# EAGLE design Power Cockpit (EAGLE 5.10)
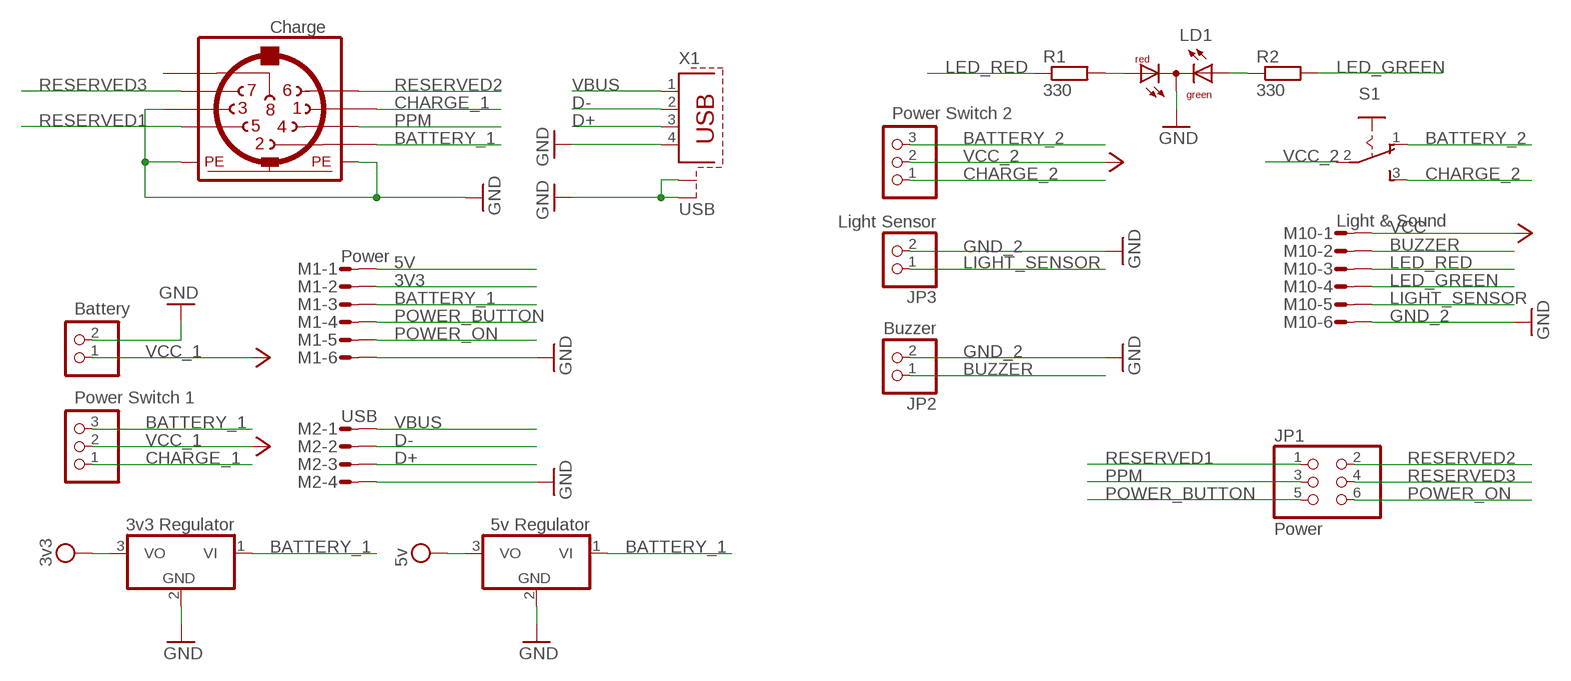
[diagram p0: schematic, sheet 1]

## Parts
BATTERY  Battery  PINHD-1X2  [1X02]
CHARGE  Charge  MAB8SH  [MAB8SH]
IC1  5v Regulator  7805T  [TO220H]
IC3  3v3 Regulator  7805T  [TO220H]
JP1  Power  PINHD-2X3  [2X03]
JP2  Buzzer  PINHD-2X1  [2X01]
JP3  Light Sensor  PINHD-2X1  [2X01]
LD1  DUOLED-RG-C  [DUOLED-C-5MM]
M1  Power  MICROMATCH-6  [MICROMATCH-6]
M2  USB  MICROMATCH-4  [MICROMATCH-4]
M10  Light & Sound  MICROMATCH-6  [MICROMATCH-6]
POWER_SWITCH_1  Power Switch 1  PINHD-1X3  [1X03]
POWER_SWITCH_2  Power Switch 2  PINHD-1X3  [1X03]
R1  330  R-EU_R0603  [R0603]
R2  330  R-EU_R0603  [R0603]
S1  255SB  [255SB]
X1  USB  PN61729-S  [PN61729-S]

## Nets
3V3: IC3.3(VO) M1.2 ; supply symbol labelled 3v3
5V: IC1.3(VO) M1.1 ; supply symbol labelled 5v
BATTERY_1: CHARGE.2 IC1.1(VI) IC3.1(VI) M1.3 POWER_SWITCH_1.3
BATTERY_2: POWER_SWITCH_2.3 S1.1(O)
BUZZER: JP2.1 M10.2
CHARGE_1: CHARGE.1 POWER_SWITCH_1.1
CHARGE_2: POWER_SWITCH_2.1 S1.3(S)
D+: M2.3 X1.3
D-: M2.2 X1.2
GND_1: BATTERY.2 CHARGE.3 CHARGE.PE CHARGE.PE@(PE) IC1.2(GND) IC3.2(GND) M1.6 M2.4 X1.4 X1.S1 X1.S2 ; supply symbol labelled GND
GND_2: JP2.2 JP3.2 LD1.C M10.6 ; supply symbol labelled GND
LED_GREEN: M10.4 R2.2
LED_RED: M10.3 R1.1
LIGHT_SENSOR: JP3.1 M10.5
N$1: LD1.AR R1.2
N$2: LD1.AX(AG) R2.1
POWER_BUTTON: JP1.5 M1.4
POWER_ON: JP1.6 M1.5
PPM: CHARGE.4 JP1.3
RESERVED1: CHARGE.5 JP1.1
RESERVED2: CHARGE.6 JP1.2
RESERVED3: CHARGE.7 JP1.4
VBUS: M2.1 X1.1
VCC: M10.1
VCC_1: BATTERY.1 POWER_SWITCH_1.2 ; supply symbol labelled VCC
VCC_2: POWER_SWITCH_2.2 S1.2(P) ; supply symbol labelled VCC
Unconnected: CHARGE.8

## Library data of the parts
BATTERY = pinhead:PINHD-1X2: PIN HEADER
CHARGE = pst-con-hirschmann:MAB8SH: Female CONNECTOR 8 pins with shield, horizontal (DIN 41524)
IC1 IC3 = pst-dimension-engineering:78*: Positive VOLTAGE REGULATOR Source: http://cache.national.com/ds/LM/LM78L05.pdf http://www.fairchildsemi.com/ds/LM/LM7805.pdf
JP1 = pinhead:PINHD-2X3: PIN HEADER
JP2 JP3 = pst-pinhead:PINHD-2X1
LD1 = led:DUOLED-RG-C: DUO LED 2 colors (red/green), 5 mm, round, common Cathode www.ligitek.com or other producers.
M1 M10 = con-amp-micromatch:MICROMATCH-6: MicroMaTch 6 7-215464-6 / 0-215464-6 Drawing Number C-215464 DDEController.pdf
M2 = con-amp-micromatch:MICROMATCH-4: MicroMaTch 4 7-215464-4 / 0-215464-4 Drawing Number C-215464 DDEController.pdf
POWER_SWITCH_1 POWER_SWITCH_2 = pinhead:PINHD-1X3: PIN HEADER
R1 R2 = resistor:R-EU_: RESISTOR, European symbol
S1 = switch:255SB: SLIDING SWITCH Distributor Buerklin, 11G810
X1 = con-berg:PN61729-S: BERG USB connector

## Board
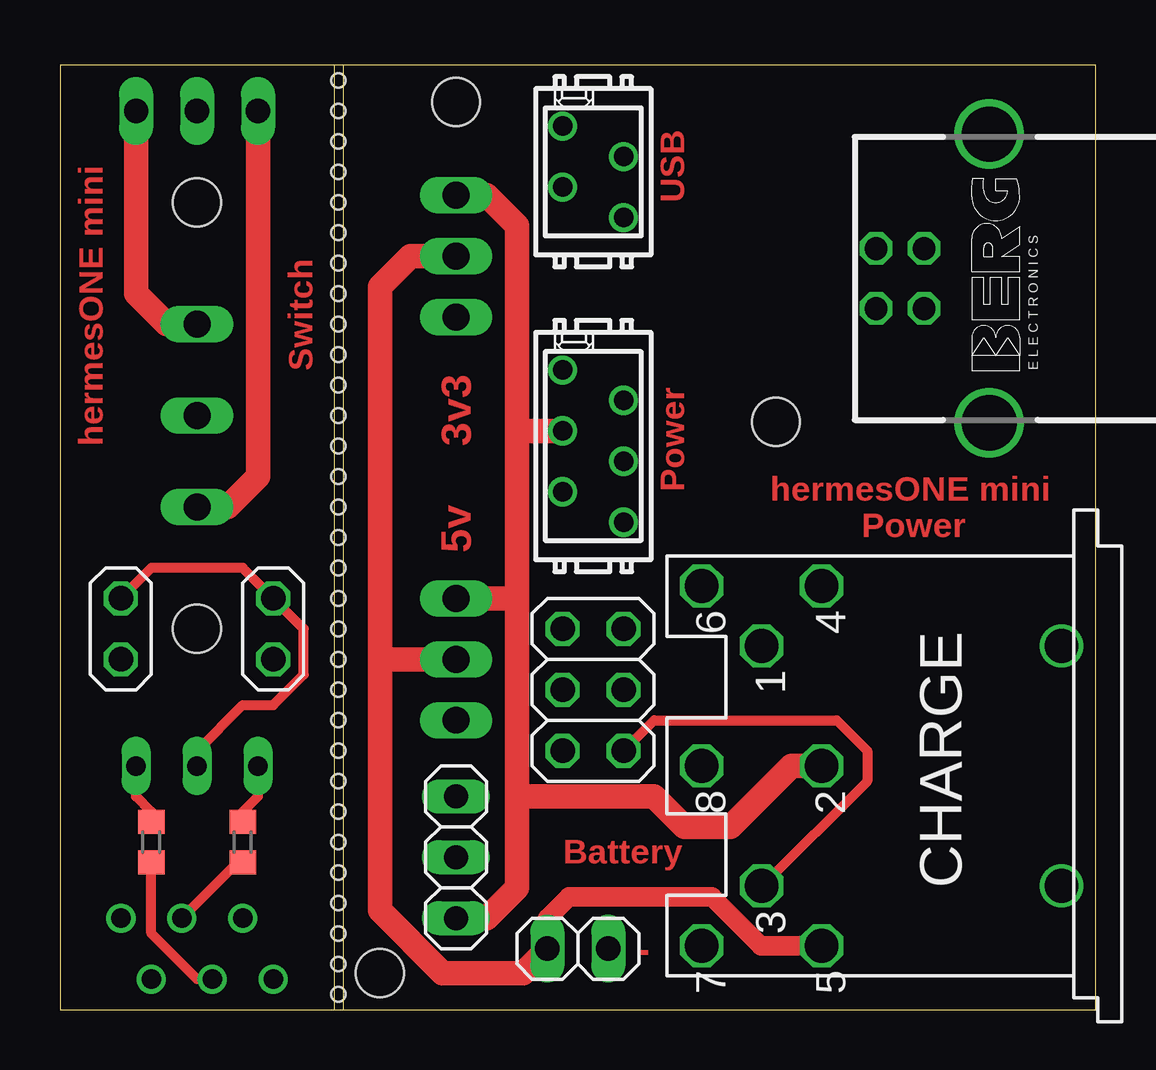
[diagram p1: board, top side]
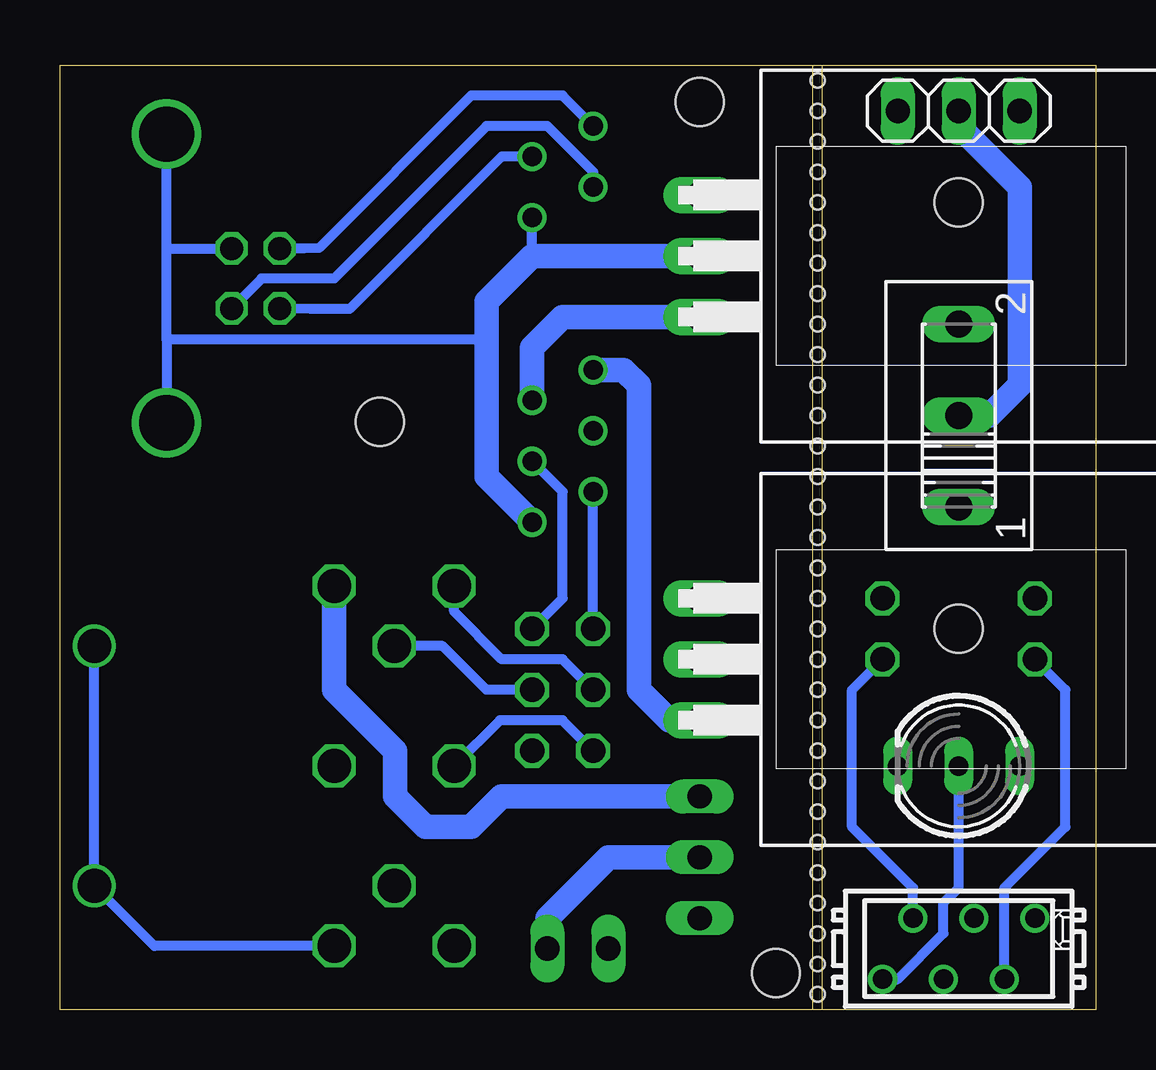
[diagram p2: board, bottom side, seen from below]

Size 43.18 x 39.37 mm. Coordinates in mm from the lower left corner, seen from the top.
Outline: 11.81,0 0,0 0,39.37 11.43,39.37
Outline: 11.81,0 43.18,0 43.18,39.37 11.81,39.37
Outline: 11.81,39.37 11.43,39.37
Outline: 11.81,39.37 11.81,0
Outline: 11.43,39.37 11.43,0
Copper layers (1*16): Top 0.035mm / dielectric 1.5mm / Bottom 0.035mm
Design rules "PCB-POOL Standard": minimum track width 0.15mm, minimum drill 0.3mm, track to track 0.15mm, track to pad 0.15mm, pad to pad 0.15mm, via to via 0.15mm, smd to smd 0.15mm, copper to edge 0.3mm, drill to drill 0.2mm, minimum pad ring 0.2mm, minimum via ring 0.15mm, stop-mask expansion 0.075mm, vias tented up to drill 0mil, thermal gap 0.2mm
Holes 0.6 mm at 11.6,38.73 11.6,1.91 11.6,37.47 11.6,36.2 11.6,34.92 11.6,33.66 11.6,32.38 11.6,31.11 11.6,29.84 11.6,28.57 11.6,27.3 11.6,26.04 11.6,22.23 11.6,24.77 11.6,23.5 11.6,20.95 11.6,19.68 11.6,18.41 11.6,17.14 11.6,15.88 11.6,14.61 11.6,13.34 11.6,12.06 11.6,10.79 11.6,9.53 11.6,8.26 11.6,6.99 11.6,5.71 11.6,4.45 11.6,3.17 11.6,0.64
Holes 2 mm at 13.34,1.52 16.51,37.85 29.84,24.51 5.71,33.66 5.71,15.88

### Footprints (pad centres in the part's own frame; a part is rotated, then mirrored left to right if it is on the bottom)
1X02 = drill 1.016 long: 1 -1.27,0; 2 1.27,0
MAB8SH = drill 1.4 octagon: 1 7.5,0; 2 0,0; 3 -7.5,0; 4 5,2.5; 5 -5,2.5; 6 0,5; 7 7.5,5; 8 -7.5,5 | drill 1.4 round: PE -5,-10; PE@ 5,-10
TO220H = drill 1.118 long: 1 -2.54,-10.16; 2 0,-10.16; 3 2.54,-10.16
2X03 = drill 1.016 octagon: 1 -2.54,-1.27; 2 -2.54,1.27; 3 0,-1.27; 4 0,1.27; 5 2.54,-1.27; 6 2.54,1.27
2X01 = drill 1.016 octagon: 1 -1.27,-1.27; 2 -1.27,1.27
DUOLED-C-5MM = drill 0.813 long: AR 2.54,0; AX -2.54,0; C 0,0
MICROMATCH-6 = drill 0.813 round: 1 3.175,1.27; 2 1.905,-1.27; 3 0.635,1.27; 4 -0.635,-1.27; 5 -1.905,1.27; 6 -3.175,-1.27
MICROMATCH-4 = drill 0.813 round: 1 1.905,1.27; 2 0.635,-1.27; 3 -0.635,1.27; 4 -1.905,-1.27
1X03 = drill 1.016 long: 1 -2.54,0; 2 0,0; 3 2.54,0
R0603 = smd 1 x 1.1: 1 -0.85,0; 2 0.85,0
255SB = drill 1.118 long: 1 -3.81,0; 2 0,0; 3 3.81,0
PN61729-S = drill 0.95 octagon: 1 1.25,4.71; 2 -1.25,4.71; 3 -1.25,2.71; 4 1.25,2.71 | drill 2.3 pad 2.9 round: S1 -6.02,0; S2 6.02,0

### Placement (x,y rotation side)
BATTERY  21.59,2.54 180 top
CHARGE  31.75,10.16 90 top
IC1  6.35,14.61 270 bottom
IC3  6.35,31.41 270 bottom
JP1  22.23,13.34 90 top
JP2  3.81,15.88 0 top
JP3  10.16,15.88 0 top
LD1  5.71,10.16 180 bottom
M1  22.23,23.5 90 top
M2  22.23,34.92 90 top
M10  5.71,2.54 0 bottom
POWER_SWITCH_1  16.51,6.35 270 top
POWER_SWITCH_2  5.71,37.47 180 bottom
R1  7.62,6.99 90 top
R2  3.81,6.99 270 top
S1  5.71,24.77 90 bottom
X1  38.73,30.48 90 top

### Tracks (layer width: path | path; a pad name or v marks a point on that pad's centre or on a via)
3V3
  Bottom 1.016: M1.2 23.5,27.61 22.23,28.88 IC3.3
5V
  Bottom 1.016: IC1.3 17.78,12.06 19.05,13.34 19.05,26.04 19.68,26.67 M1.1
BATTERY_1
  Top 1.016: 19.05,24.13 19.05,32.69 17.78,33.95 IC3.1 | 19.05,24.13 M1.3 | 19.05,8.89 19.05,5.08 17.78,3.81 POWER_SWITCH_1.3 | 19.05,8.89 19.05,17.14 | 19.05,17.14 19.05,24.13 | CHARGE.2 30.48,10.16 27.94,7.62 26.04,7.62 24.77,8.89 19.05,8.89 | 19.05,17.14 IC1.1
BATTERY_2
  Top 1.016: POWER_SWITCH_2.3 8.26,22.23 6.99,20.95 S1.1
BUZZER
  Bottom 0.406: M10.2 3.81,5.08 1.27,7.62 1.27,13.34 JP2.1
CHARGE_1
  Bottom 1.016: POWER_SWITCH_1.1 24.77,8.89 26.04,7.62 27.94,7.62 29.21,8.89 29.21,10.79 31.75,13.34 CHARGE.1
CHARGE_2
  Top 1.016: POWER_SWITCH_2.1 3.17,29.84 4.45,28.57 S1.3
D+
  Bottom 0.406: M2.3 20.95,34.92 22.86,36.83 25.4,36.83 31.75,30.48 34.77,30.48 X1.3
D-
  Bottom 0.406: M2.2 24.77,35.56 31.11,29.21 32.73,29.21 X1.2
GND_1
  Top 0.813: BATTERY.2 20.32,3.81 21.21,4.7 27.18,4.7 29.21,2.66 CHARGE.3
  Top 1.016: IC3.2 14.61,31.41 13.34,30.14 13.34,14.61 | 13.34,14.61 13.34,4.14 15.96,1.52 19.3,1.52 BATTERY.2 | 13.34,14.61 IC1.2
  Bottom 0.406: 23.5,31.41 M2.4 | CHARGE.PE@ CHARGE.PE 39.25,2.66 CHARGE.3 | 25.4,24.77 25.7,24.46 | 25.4,27.94 38.73,27.94 | 38.73,27.94 X1.S1 | 38.73,27.94 38.73,31.75 | 38.73,31.75 X1.S2 | X1.4 38.72,31.73 38.73,31.75
  Bottom 1.016: IC3.2 23.5,31.41 25.4,29.51 25.4,27.94 25.4,24.77 25.4,22.23 M1.6
GND_2
  Top 0.406: LD1.C 5.71,10.79 7.62,12.7 8.89,12.7 10.16,13.97 10.16,15.88 JP3.2 7.62,18.41 3.81,18.41 JP2.2
  Bottom 0.406: LD1.C 5.71,5.08 6.35,4.45 6.35,3.17 8.26,1.27 M10.6
LED_GREEN
  Top 0.406: M10.4 5.71,1.27 3.81,3.17 R2.2
LED_RED
  Top 0.406: R1.1 7.41,6.13 M10.3
LIGHT_SENSOR
  Bottom 0.406: M10.5 7.62,5.08 10.16,7.62 10.16,13.34 JP3.1
N$1
  Top 0.406: LD1.AR 8.26,8.89 7.62,8.26 R1.2
N$2
  Top 0.406: LD1.AX 3.17,8.89 3.81,8.26 R2.1
POWER_BUTTON
  Bottom 0.406: M1.4 22.23,21.59 22.23,17.14 JP1.5
POWER_ON
  Bottom 0.406: JP1.6 M1.5
PPM
  Bottom 0.406: JP1.3 25.4,13.34 27.23,15.16 CHARGE.4
RESERVED1
  Top 0.406: CHARGE.5 29.29,5.16 33.66,9.53 33.66,10.79 32.38,12.06 24.77,12.06 JP1.1
RESERVED2
  Bottom 0.406: JP1.2 22.23,12.06 24.84,12.06 CHARGE.6
RESERVED3
  Bottom 0.406: JP1.4 22.23,14.61 24.77,14.61 26.75,16.59 CHARGE.7
VBUS
  Bottom 0.406: M2.1 22.23,38.1 26.04,38.1 32.38,31.75 33.02,31.73 X1.1
VCC_1
  Bottom 1.016: POWER_SWITCH_1.2 20.32,6.35 22.86,3.81 BATTERY.1
VCC_2
  Bottom 1.016: POWER_SWITCH_2.2 5.71,36.83 3.17,34.29 3.17,26.04 4.45,24.77 S1.2

### Text on the board
Top: USB | Switch | hermesONE mini | 3v3 | Power | hermesONE mini | Power | 5v | Battery | -